# EasyEDA Pro project AG6NS_PicoBalloon_RP2040_v0.4.eprj, board PCB1
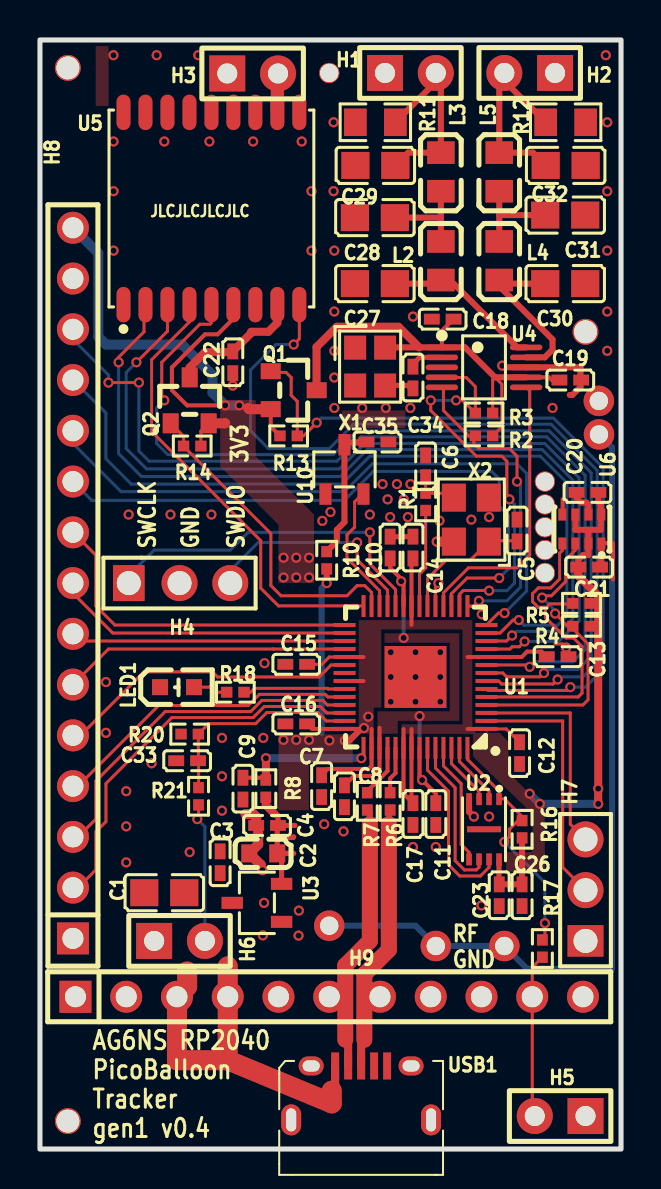
[diagram p1: board, top side]
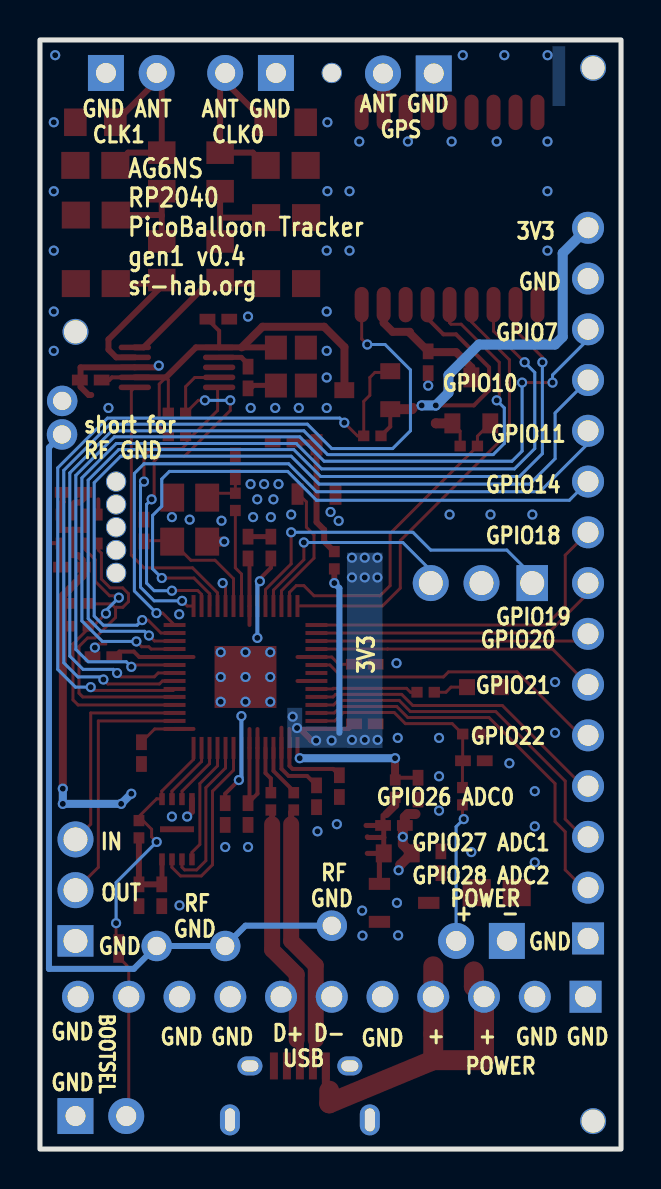
[diagram p2: board, bottom side, seen from below]

Outline 29.08 x 55.5 mm; copper layers: Top Layer, Bottom Layer. Coordinates in mm from the lower left corner of the outline.
Outline path: rectangle 0,55.5 29.08,0
Stack: Top Layer 0.035mm / Dielectric1 1.51mm FR4 er 4.5 / Bottom Layer 0.035mm

## Design rules (mm)
spacing safeClearance (default): track to track 0.152, other pairs 0.152 to 0.3
track width trackWidth (default): min 0.127, default 0.254, max 2.54
differential pair differentialPair (default): width min 0.127, default 0.254, max 2.54; gap min 0.152, default 0.152
via viaSize (default): diameter min 0.5, default 0.61, max 10; hole min 0.3, default 0.305, max 6

## Placement (name value [footprint] x y rotation side)
C1  22uF  [C0805]  6.22 12.83 0 top
C2  22uF  [C0603]  11.18 14.8 0 top
C3  100nF  [C0402_NEW]  9.02 14.35 270 top
C4  100nF  [C0402_NEW]  11.37 16.19 0 top
C5  33pF  [C0402]  23.88 30.95 270 top
C6  33pF  [C0402]  19.3 34.16 270 top
C7  2.2uF  [C0402]  14.1 18.16 90 top
C8  2.2uF  [C0402]  15.24 17.65 90 top
C9  2.2uF  [C0402]  10.16 18.03 90 top
C10  100nF  [C0402_NEW]  17.53 30.1 270 top
C11  100nF  [C0402_NEW]  19.81 16.76 90 top
C12  100nF  [C0402_NEW]  24 19.81 90 top
C13  100nF  [C0402_NEW]  25.91 24.64 180 top
C14  100nF  [C0402_NEW]  18.67 30.1 270 top
C15  100nF  [C0402_NEW]  12.83 24.26 0 top
C16  100nF  [C0402_NEW]  12.83 21.27 0 top
C17  100nF  [C0402_NEW]  18.67 16.76 90 top
C18  100nF  [C0402_NEW]  20.16 41.53 0 top
C19  100nF  [C0402_NEW]  26.54 38.48 180 top
C20  100nF  [C0402_NEW]  27.4 32.86 0 top
C21  100nF  [C0402_NEW]  27.49 29.12 180 top
C22  100nF  [C0402_NEW]  9.65 39.37 90 top
C23  100nF  [C0402_NEW]  22.99 12.7 90 top
C26  2.2uF  [C0402]  24.13 12.7 90 top
C27  330pF  [C0805]  16.76 43.31 0 top
C28  330pF  [C0805]  16.76 46.61 0 top
C29  330pF  [C0805]  16.79 49.22 0 top
C30  330pF  [C0805]  26.29 43.31 180 top
C31  330pF  [C0805]  26.29 46.74 180 top
C32  330pF  [C0805]  26.31 49.22 180 top
C33  1nF  [C0402]  7.37 19.43 0 top
C34  100nF  [C0402_NEW]  18.67 38.61 270 top
C35  100nF  [C0402_NEW]  16.89 35.38 180 top
H1  210-91-02GB01  [HDR-TH_2P-P2.54-V-M-1]  18.54 53.85 0 top
H2  210-91-02GB01  [HDR-TH_2P-P2.54-V-M-1]  24.51 53.85 180 top
H3  210-91-02GB01  [HDR-TH_2P-P2.54-V-M-1]  10.64 53.82 0 top
H4  B-2100S03P-A110  [HDR-TH_3P-P2.54-V-M-1]  6.99 28.32 0 top
H5  210-91-02GB01  [HDR-TH_2P-P2.54-V-M-1]  26.03 1.65 180 top
H6  210-91-02GB01  [HDR-TH_2P-P2.54-V-M-1]  6.99 10.41 0 top
H7  B-2100S03P-A110  [HDR-TH_3P-P2.54-V-M-1]  27.31 12.95 90 top
H8  B-2100S15P-A110  [HDR-TH_15P-P2.54-V-M]  1.65 28.32 90 top
H9  A2541WV-11P  [HDR-TH_11P-P2.54-V-M]  14.48 7.62 0 top
L2  820nH  [L0805]  20.07 44.45 90 top
L3  820nH  [L0805]  20.07 48.9 90 top
L4  820nH  [L0805]  22.99 44.45 90 top
L5  820nH  [L0805]  22.99 48.9 90 top
LED1  GREEN  [LED0603-R-RD]  6.86 23.11 0 top
NOREF  -  [Pad_e5590]  1.4 1.4 0 top
NOREF#2  -  [Pad_e19824]  27.97 37.44 0 top
NOREF#3  -  [Pad_e4428]  23.24 10.16 0 top
NOREF#4  -  [Pad_e5896]  1.4 54.1 0 top
NOREF#5  -  [Pad_e19751]  27.98 35.76 0 top
NOREF#6  -  [Pad_e13409]  25.27 29.97 0 top
NOREF#7  -  [Pad_e5895]  27.31 40.89 0 top
NOREF#8  -  [Pad_e13209]  25.27 32.26 0 top
NOREF#9  -  [Pad_e12433]  25.27 33.4 0 top
NOREF#10  -  [Pad_e28937]  14.48 53.85 0 top
NOREF#11  -  [Pad_e13408]  25.27 31.12 0 top
NOREF#12  -  [Pad_e9054]  19.81 10.16 0 top
NOREF#13  -  [Pad_e6]  14.48 11.18 0 top
NOREF#14  -  [Pad_e18196]  25.27 28.83 0 top
Q1  AO3401A  [SOT-23_L2.9-W1.3-P1.90-LS2.4-BR]  12.7 37.97 180 top
Q2  AO3401A  [SOT-23_L2.9-W1.3-P1.90-LS2.4-BR]  7.49 37.47 270 top
R1  1kΩ  [R0402]  19.3 32.39 270 top
R2  3.3kΩ  [R0402]  22.22 35.69 0 top
R3  3.3kΩ  [R0402]  22.22 36.83 0 top
R4  10kΩ  [R0402]  27.1 26.16 0 top
R5  10kΩ  [R0402]  27.1 27.31 0 top
R6  22  [R0402]  17.53 17.4 270 top
R7  22  [R0402]  16.38 17.4 270 top
R8  200Ω  [R0402]  11.3 18.03 270 top
R10  10kΩ  [R0402]  14.35 29.46 270 top
R11  2kΩ  [R0805]  16.79 51.38 0 top
R12  2kΩ  [R0805]  26.31 51.38 180 top
R13  10kΩ  [R0402]  12.45 35.69 180 top
R14  10kΩ  [R0402]  7.62 35.18 0 top
R16  10kΩ  [R0402]  24.13 16 270 top
R17  1kΩ  [R0402]  25.15 10.03 270 top
R18  6.8kΩ  [R0402]  9.78 22.86 0 top
R20  100kΩ  [R0402]  7.49 20.76 180 top
R21  200kΩ  [R0402]  7.94 17.65 270 top
U1  RP2040  [LQFN-56_L7.0-W7.0-P0.4-EP]  18.8 23.62 180 top
U2  W25Q16JVUXIQ  [USON-8_L3.0-W2.0-P0.50-BL-EP]  22.22 16 180 top
U3  3.3V LDO  [SOT-23-3_L2.9-W1.6-P1.90-LS2.8-BR]  10.86 12.32 0 top
U4  MS5351M  [MSOP-10_L3.0-W3.0-P0.50-LS5.0-BL]  22.22 39.12 270 top
U5  ATGM336H-5N31  [GPSM-SMD_ATGM336H-TR]  8.58 47.07 180 top
U6  BMP280  [WLGA-8_L2.5-W2.0-P0.65-TR_DPS422]  27.12 31.03 270 top
U10  MAX809STRG  [SOT-23-3_L2.9-W1.6-P1.90-LS2.8-BR]  15.24 34.01 270 top
USB1  Micro-USB Connector  [MICRO-USB-SMD_10118194-0001LF]  16.07 2.81 0 top
X1  26MHz  [OSC-SMD_4P-L2.5-W2.0-BL]  16.52 39.15 270 top
X2  12MHz  [OSC-SMD_4P-L3.2-W2.5-BL]  21.59 31.5 90 top

## Footprints (pads in the part's own frame, mm; a bottom-side part is the same pattern mirrored in y, then rotated)
C0402
  rect 0.79x0.54 smd: 1(-0.545,0) 2(0.545,0)
C0402_NEW
  rect 0.79x0.54 smd: 1(-0.545,0) 2(0.545,0)
C0603
  rect 0.8x0.9 smd: 1(-0.7,0) 2(0.7,0)
C0805
  rect 1.41x1.35 smd: 1(-1,0) 2(1,0)
GPSM-SMD_ATGM336H-TR
  oval 0.7x1.773 smd: 1(4.4,4.811) 2(3.3,4.811) 3(2.2,4.811) 4(1.1,4.811) 5(0,4.811) 6(-1.1,4.811) 7(-2.2,4.811) 8(-3.3,4.811) 9(-4.4,4.811) 10(-4.4,-4.811) 11(-3.3,-4.811) 12(-2.2,-4.811) 13(-1.1,-4.811) 14(0,-4.811) 15(1.1,-4.811) 16(2.2,-4.811) 17(3.3,-4.811) 18(4.4,-4.811)
HDR-TH_2P-P2.54-V-M-1
  rect 1.8x1.8 hole 1: 1(-1.27,0)
  round 1.8 hole 1: 2(1.27,0)
HDR-TH_3P-P2.54-V-M-1
  rect 1.575x1.8 hole 1.2: 1(-2.54,0)
  round 1.8 hole 1.2: 2(0,0) 3(2.54,0)
HDR-TH_11P-P2.54-V-M
  rect 1.6x1.6 hole 1.05: 1(-12.7,0)
  round 1.6 hole 1.05: 2(-10.16,0) 3(-7.62,0) 4(-5.08,0) 5(-2.54,0) 6(0,0) 7(2.54,0) 8(5.08,0) 9(7.62,0) 10(10.16,0) 11(12.7,0)
HDR-TH_15P-P2.54-V-M
  rect 1.6x1.6 hole 1.05: 1(-17.78,0)
  round 1.6 hole 1.05: 2(-15.24,0) 3(-12.7,0) 4(-10.16,0) 5(-7.62,0) 6(-5.08,0) 7(-2.54,0) 8(0,0) 9(2.54,0) 10(5.08,0) 11(7.62,0) 12(10.16,0) 13(12.7,0) 14(15.24,0) 15(17.78,0)
L0805
  rect 1.133x1.377 smd: 1(-0.966,0) 2(0.966,0)
LED0603-R-RD
  rect 0.8x0.8 smd: 1(0.851,0) 2(-0.851,0)
LQFN-56_L7.0-W7.0-P0.4-EP
  rect 1.1x0.2 smd: 1(-3.55,2.6) 2(-3.55,2.2) 3(-3.55,1.8) 4(-3.55,1.4) 5(-3.55,1) 6(-3.55,0.6) 7(-3.55,0.2) 8(-3.55,-0.2) 9(-3.55,-0.6) 10(-3.55,-1) 11(-3.55,-1.4) 12(-3.55,-1.8) 13(-3.55,-2.2) 14(-3.55,-2.6) 29(3.55,-2.6) 30(3.55,-2.2) 31(3.55,-1.8) 32(3.55,-1.4) 33(3.55,-1) 34(3.55,-0.6) 35(3.55,-0.2) 36(3.55,0.2) 37(3.55,0.6) 38(3.55,1) 39(3.55,1.4) 40(3.55,1.8) 41(3.55,2.2) 42(3.55,2.6)
  rect 0.2x1.1 smd: 15(-2.6,-3.55) 16(-2.2,-3.55) 17(-1.8,-3.55) 18(-1.4,-3.55) 19(-1,-3.55) 20(-0.6,-3.55) 21(-0.2,-3.55) 22(0.2,-3.55) 23(0.6,-3.55) 24(1,-3.55) 25(1.4,-3.55) 26(1.8,-3.55) 27(2.2,-3.55) 28(2.6,-3.55) 43(2.6,3.55) 44(2.2,3.55) 45(1.8,3.55) 46(1.4,3.55) 47(1,3.55) 48(0.6,3.55) 49(0.2,3.55) 50(-0.2,3.55) 51(-0.6,3.55) 52(-1,3.55) 53(-1.4,3.55) 54(-1.8,3.55) 55(-2.2,3.55) 56(-2.6,3.55)
  rect 3.1x3.1 smd: 57(0,0)
MICRO-USB-SMD_10118194-0001LF
  rect 0.4x1.35 smd: 1(-1.3,1.35) 2(-0.65,1.35) 3(0,1.35) 4(0.65,1.35) 5(1.3,1.35)
  oval 1x1.55 hole 0.5x1.15: 6(-3.5,-1.35) 6(3.5,-1.35)
  oval 1.25x0.95 hole 0.85x0.55: 6(-2.5,1.35) 6(2.5,1.35)
MSOP-10_L3.0-W3.0-P0.50-LS5.0-BL
  oval 0.28x1.62 smd: 1(-1,-2.11) 2(-0.5,-2.11) 3(0,-2.11) 4(0.5,-2.11) 5(1,-2.11) 6(1,2.11) 7(0.5,2.11) 8(0,2.11) 9(-0.5,2.11) 10(-1,2.11)
OSC-SMD_4P-L2.5-W2.0-BL
  rect 1.2x1.1 smd: 1(-0.95,-0.75) 2(0.95,-0.75) 3(0.95,0.75) 4(-0.95,0.75)
OSC-SMD_4P-L3.2-W2.5-BL
  rect 1.4x1.2 smd: 1(-1.1,-0.875) 2(1.1,-0.875) 3(1.1,0.875) 4(-1.1,0.875)
Pad_e6
  round 1.524 hole 0.914: 6(0,0)
Pad_e4428
  round 1.524 hole 0.914: 1(0,0)
Pad_e5590
  round 1.3 hole 1.152: 3(0,0)
Pad_e5895
  round 1.3 hole 1.152: 2(0,0)
Pad_e5896
  round 1.3 hole 1.152: 1(0,0)
Pad_e9054
  round 1.524 hole 0.914: 5(0,0)
Pad_e12433
  round 1.016 hole 0.914: 0(0,0)
Pad_e13209
  round 1.016 hole 0.914: 0(0,0)
Pad_e13408
  round 1.016 hole 0.914: 0(0,0)
Pad_e13409
  round 1.016 hole 0.914: 0(0,0)
Pad_e18196
  round 1.016 hole 0.914: 0(0,0)
Pad_e19751
  round 1.524 hole 0.914: 2(0,0)
Pad_e19824
  round 1.524 hole 0.914: 3(0,0)
Pad_e28937
  round 1.016 hole 0.914: 0(0,0)
R0402
  rect 0.566x0.54 smd: 1(-0.433,0) 2(0.433,0)
R0805
  rect 1.133x1.377 smd: 1(-1,0) 2(1,0)
SOT-23-3_L2.9-W1.6-P1.90-LS2.8-BR
  rect 1.07x0.6 smd: 1(1.235,-0.95) 2(1.235,0.95) 3(-1.235,0)
SOT-23_L2.9-W1.3-P1.90-LS2.4-BR
  rect 1x0.8 smd: 1(1.15,-0.95) 2(1.15,0.95) 3(-1.15,0)
USON-8_L3.0-W2.0-P0.50-BL-EP
  rect 0.28x0.6 smd: 1(-0.75,-1.508) 2(-0.25,-1.508) 3(0.25,-1.508) 4(0.75,-1.508) 5(0.75,1.508) 6(0.25,1.508) 7(-0.25,1.508) 8(-0.75,1.508)
  rect 1.7x0.3 smd: 9(0,0)
WLGA-8_L2.5-W2.0-P0.65-TR_DPS422
  rect 0.6x0.4 smd: 1(0.725,0.975) 2(0.725,0.325) 3(0.725,-0.325) 4(0.725,-0.975) 5(-0.725,-0.975) 6(-0.725,-0.325) 7(-0.725,0.325) 8(-0.725,0.975)

## Nets
As in the schematic, except:
GND: C1.1 C2.1 C3.1 C4.1 C5.1 C6.1 C7.1 C8.1 C9.1 C10.1 C11.1 C12.1 C13.1 C14.1 C15.1 C16.1 C17.1 C18.1 C19.1 C20.1 C21.1 C22.1 C23.1 C26.1 C27.1 C28.1 C29.1 C30.1 C31.1 C32.1 C33.1 C35.1 H1.1 H2.1 H3.1 H4.2 H5.1 H6.1 H7.1 H8.1 H8.14 H9.1 H9.2 H9.5 H9.8 H9.9 H9.11 LED1.2 NOREF#2.3 R11.1 R12.1 R20.2 U1.19 U1.57 U2.4 U3.1 U4.8 U5.1 U5.10 U5.12 U6.1 U6.5 U6.7 U10.1 USB1.5 USB1.6 X1.1 X1.2 X2.2 X2.4
RFGND: NOREF#3.1 NOREF#5.2 NOREF#12.5 NOREF#13.6

Pads without a net: NOREF 3; NOREF#4 1; NOREF#6 0; NOREF#7 2; NOREF#8 0; NOREF#9 0; NOREF#10 0; NOREF#11 0; NOREF#14 0; U2 9; U4 3; U5 7 13 14 15 16 17 18; USB1 4

## Via types
v1: diameter 0.508, hole 0.3, Top Layer to Bottom Layer, 141 vias

## Routing (per net, layer and track width the routed paths; a pad name or vN(x,y) marks a point on that pad's centre or on a via; arc(x,y) is an arc through that point)
1V1: length 16
  Top Layer w0.2: 17.53,29.54 17.53,29.08 18.2,28.41 U1.23 ; 17,21.08 U1.45 17,19.03 16.64,18.67 15.71,18.67 C8.2 ; C11.2 19.81,17.78 19,18.6 U1.50
  Bottom Layer w0.2: v1(18.08,28.41) 18.2,28.29 v1(18.2,25.58) ; v1(19,21.67) 19,18.59 v1(19.13,18.46)
3V3: length 102.3
  Top Layer w0.15: U1.33 14.48,24.62 14.11,24.26 C15.2 ; 22.35,21.02 23.34,21.02 C12.2 ; R14.2 8.05,35.93 8.44,36.32
  Top Layer w0.2: C13.2 25.11,24.89 24.38,24.89 24.11,24.62 U1.10 21.4,24.62 ; 22.35,21.02 21.4,21.02 ; U5.6 9.68,41.56 8.89,40.77 8.25,40.77 6.6,39.12 6.6,37.97 7.37,37.21 v1(9.27,37.21) ; 28.07,31.72 U6.8 ; 16.22,21.02 16.17,21.02 ; 16.17,21.02 13.62,21.02 C16.2 ; 16.17,21.02 v1(16.22,21.07) ; Q1.2 11.55,36.15 R13.2 ; 18.6,21.02 U1.49 18.6,17.38 ; 18.6,17.38 18.2,17.78 U1.48 18.2,21.02 ; 18.6,17.38 C17.2 ; C7.2 14.41,19.02 16.45,19.02 16.6,19.17 U1.44 16.6,21.02 ; U1.36 16.19,23.42 ; 18.6,26.23 U1.22 18.6,29.48 C14.2 18.67,29.68 ; U1.33 16.19,24.62
  Top Layer w0.25: U2.8 22.97,13.26 C23.2
  Top Layer w0.254: 12.7,15.62 12.67,15.59 11.88,15.59 ; C4.2 11.91,16.7 ; C4.2 12.76,16.19 ; C4.2 11.88,16.16 11.88,15.59 ; C2.2 12.09,14.58 U3.2 ; C2.2 11.88,15.59 ; C2.2 12.7,14.8
  Top Layer w0.3: 27.43,30.99 26.8,30.99 26.8,31.75 ; 27.43,30.99 28.07,30.99 28.07,31.72 ; 27.43,30.99 27.45,30.97 27.45,29.73 27.43,29.72 27.18,29.72 26.94,29.48 C21.2 ; 16.07,21.02 15.49,20.44 v1(15.26,20.44) ; C23.2 C26.2 R16.2 ; C20.2 27.95,32.38 28.07,32.26 28.07,31.78 U6.8 ; v1(14.35,28.32) R10.2
  Top Layer w0.4: 11.75,16.76 11.3,17.21 R8.2 ; v1(27.94,17.27) v1(27.94,18.03) 27.94,27.69 26.94,28.69 C21.2
  Top Layer w0.5: Q1.2 10.47,37.02 10.41,37.08 ; 8.44,36.32 9.26,36.32 9.27,36.32
  Bottom Layer w0.3: 14.1,20.83 14.1,28.07 v1(14.35,28.32)
  Bottom Layer w0.4: v1(27.94,18.03) v1(27.94,17.27) v1(25.02,17.27) v1(24.51,17.78)
  Bottom Layer w0.5: v1(9.98,37.21) v1(9.27,37.21) 8.64,37.85 8.64,38.74 7.11,40.26 3.3,40.26 2.92,40.64 2.92,44.83 H8.15
  vias: v1(12.19,29.59) v1(12.19,28.6) v1(12.19,20.47) v1(12.83,29.59) v1(12.83,28.6) v1(12.83,20.47) v1(13.47,29.59) v1(13.47,28.6) v1(13.47,20.47) v1(14.49,20.44) v1(16.43,21.64)
GND: length 20.9
  Top Layer w0.15: 25.78,25.27 26.16,25.27 v1(26.33,25.09) 26.45,24.98 C13.1 ; U1.19 19.8,28.18 v1(19.94,28.32)
  Top Layer w0.2: 28.09,30.32 28.66,30.32 28.68,30.29 28.68,28.51 ; 26.16,32.51 26.16,31.77 U6.5 ; v1(9.65,38.2) C22.1
  Top Layer w0.254: C10.1 C14.1
  Top Layer w0.3: 27.45,31.75 27.45,32.24 27.34,32.35 27.08,32.35 26.86,32.58 C20.1 ; C21.1 28.07,29.16 28.07,29.72 28.1,29.75 U6.1 ; v1(23.14,39.2) 23.22,39.12 U4.8 27.05,39.12 27.05,38.14 26.65,37.73 26.52,37.73 ; v1(21.72,16.64) 21.47,16.88 U2.4
  Top Layer w0.5: 11.05,14.22 11.05,14.22 C2.1 10.92,15.24 v1(10.92,15.62) 10.92,16.09 C4.1 10.82,16.61 10.67,16.76 10.29,16.76 ; v1(19.86,30.4) X2.4
  vias: v1(3.3,23.37) v1(3.3,20.83) v1(3.68,54.74) v1(3.68,50.42) v1(3.68,47.93) v1(3.68,44.96) v1(4.32,17.91) v1(4.32,16.15) v1(4.32,14.34) v1(4.44,31.75) v1(5.59,19.3) v1(5.84,54.74) v1(6.22,50.42) v1(6.53,31.75) v1(7.49,14.86) v1(7.92,54.74) v1(8.48,50.42) v1(8.58,31.75) v1(9.11,20.57) v1(9.11,18.65) v1(9.11,16.93) v1(10.67,50.42) v1(11.13,13.95) v1(11.24,24.31) v1(11.18,20.57) v1(11.22,12.32) v1(11.16,10.69) v1(12.94,10.68) v1(12.96,11.93) v1(13.1,50.42) v1(13.59,47.93) v1(13.59,44.96) v1(14.13,31.43) v1(14.22,16.26) v1(14.54,31.88) v1(14.7,51.38) v1(14.7,47.93) v1(14.73,44.96) v1(14.73,41.91) v1(14.73,39.94) v1(14.73,38.61) v1(14.73,37.08) v1(15.19,15.9) v1(16.13,37.08) v1(16.51,31.75) v1(17.15,33.27) v1(17.31,37.08) v1(17.4,32.51) v1(17.53,31.62) v1(17.56,24.86) v1(17.56,23.62) v1(17.56,22.38) v1(17.87,33.27) v1(18.21,32.51) v1(18.41,31.62) v1(18.54,37.08) v1(18.54,33.27) v1(18.67,41.66) v1(18.67,15.11) v1(18.8,24.86) v1(18.8,23.62) v1(18.8,22.38) v1(19.81,15.11) v1(20,31.44) v1(20.04,24.86) v1(20.04,23.62) v1(20.04,22.38) v1(21.59,31.5) v1(22.11,26.76) v1(22.1,12.19) v1(22.48,31.62) v1(22.48,16.64) v1(25.65,37.08) v1(28.32,54.74) v1(28.39,51.38) v1(28.39,47.93) v1(28.39,44.96) v1(28.39,41.91) v1(28.39,39.94)
VBUS: length 26.5
  Top Layer w0.15: 7.94,17.22 7.94,16.57 v1(7.87,16.51)
  Top Layer w0.4: 14.6,2.92 14.77,3.09 USB1.1
  Top Layer w1: 9.4,4.45 14.6,2.29 14.6,2.92 ; 9.4,4.45 6.86,4.45 H9.3 7.37,8.13 7.37,8.89 ; 9.4,4.45 H9.4 9.4,9.14
  Bottom Layer w0.15: v1(7.87,16.51) 8.25,16.13 H6.2
ADC0: length 15.7
  Top Layer w0.15: 1.65,17.91 5.94,22.2 10.42,22.2 10.98,22.75 14.28,22.75 14.41,22.62 U1.38
ADC1: length 17.7
  Top Layer w0.15: 1.65,15.37 2.79,16.51 2.79,18.42 6.27,21.89 10.55,21.89 11.1,22.45 14.16,22.45 14.38,22.22 U1.39
ADC2: length 19.8
  Top Layer w0.15: 1.65,12.83 2.79,13.97 2.79,15.88 3.3,16.38 3.3,18.29 6.6,21.59 10.67,21.59 11.23,22.15 14.03,22.15 14.36,21.82 U1.40
ADC_AVDD: length 7.1
  Top Layer w0.2: C9.2 11.19,18.58 R8.1
  Top Layer w0.4: R8.1 11.31,18.47 v1(11.31,19.56)
  Bottom Layer w0.4: v1(16.08,19.56) v1(11.31,19.56)
BATT_V: length 10.6
  Top Layer w0.15: R21.1 7.94,19.4 C33.2 7.93,19.45 R20.1 8.45,21.29 10.8,21.29 11.35,21.84 13.91,21.84 14.33,21.42 U1.41
BOOTSEL: length 8.2
  Top Layer w0.15: H5.2 24.64,1.78 H9.10 24.64,9.09 R17.2
GPIO7: length 46.3
  Top Layer w0.15: U1.9 24.42,24.22 v1(24.51,24.13) ; v1(3.43,38.35) v1(4.95,38.35)
  Bottom Layer w0.15: v1(3.43,38.35) 3.43,38.74 1.91,40.26 1.91,40.77 H8.13 ; v1(4.95,38.35) 4.95,34.93 5.46,34.42 14.86,34.42 16.08,35.64 25.36,35.64 27.29,33.71 27.29,25 26.67,24.38 24.76,24.38 v1(24.51,24.13)
GPIO10: length 40.6
  Top Layer w0.15: v1(23.97,26.47) 23.68,26.47 23.03,25.82 U1.13
  Bottom Layer w0.15: H8.12 3.3,36.83 3.3,34.54 4.57,33.27 15.11,33.27 16.51,34.67 25.04,34.67 26.37,33.35 26.37,26.67 25.91,26.21 24.22,26.21 v1(23.97,26.47)
GPIO11: length 33.7
  Top Layer w0.15: v1(23.25,26.82) 22.94,26.82 U1.14
  Bottom Layer w0.15: v1(23.25,26.82) 24.36,27.92 24.36,33.81 23.88,34.29 16.64,34.29 15.24,32.89 4.06,32.89 1.65,35.31 H8.11
GPIO14: length 31.1
  Top Layer w0.15: v1(22.99,28.58) 21.38,28.58 20.59,27.78 20.59,27.19
  Bottom Layer w0.15: H8.10 2.59,32.46 15.24,32.46 16.68,33.91 22.61,33.91 22.99,33.53 22.99,32.16 23.45,31.7 23.45,29.03 v1(22.99,28.58)
GPIO18: length 17
  Top Layer w0.15: H8.9 2.79,29.72 2.79,27.18 3.75,26.22 U1.29
GPIO19: length 14.9
  Top Layer w0.15: H8.8 1.65,27.81 3.64,25.82 U1.30
GPIO20: length 13.7
  Top Layer w0.15: H8.7 2.01,25.42 U1.31
GPIO21: length 14.3
  Top Layer w0.15: H8.6 3.43,25.02 11.68,25.02 11.69,25.02 15.25,25.02
GPIO22: length 15.3
  Top Layer w0.15: H8.5 2.03,20.7 5.21,23.88 8.64,23.88 8.89,23.62 13.97,23.62 14.57,24.22 U1.34
GPS_1PPS: length 22.8
  Top Layer w0.15: U1.28 16.19,27.18 11.94,27.18 11.05,28.07 11.05,30.44 5.59,35.9 5.59,39.5 7.48,41.39 U5.4
GPS_3V3: length 6.7
  Top Layer w0.4: C22.2 10.57,40.84 10.57,40.89 11.43,40.89 11.88,41.35 U5.8 ; Q2.3 7.49,39.12 8.25,39.88 9.62,39.88
GPS_NRESET: length 42.7
  Top Layer w0.15: v1(25.91,23.5) 25.69,23.27 23.1,23.27 22.95,23.42 U1.7 ; U5.9 12.98,40.54 v1(12.7,40.26)
  Bottom Layer w0.15: v1(25.91,23.5) 26.03,23.62 27.18,23.62 27.89,24.34 27.89,33.96 25.58,36.27 15.7,36.27 14.48,35.05 11.43,35.05 10.54,35.94 10.54,38.99 11.81,40.26 v1(12.7,40.26)
GPS_ON: length 46.7
  Top Layer w0.15: v1(25.22,23.82) 25.04,23.63 23.36,23.63 23.17,23.82 U1.8 ; U5.5 8.58,41.35 8.51,41.28 8,41.28 6.1,39.37 6.1,37.59 v1(6.22,37.47)
  Bottom Layer w0.15: v1(25.22,23.82) 25.41,24 26.92,24 27.59,24.67 27.59,33.84 25.48,35.94 15.88,35.94 14.68,34.75 6.4,34.75 5.84,35.31 5.84,37.08 v1(6.22,37.47)
GPS_VCC_ON_N: length 16.5
  Top Layer w0.15: Q2.1 7.19,35.67 R14.1 7.19,35.17 11.56,30.8 11.56,28.19 12.06,27.69 15.37,27.69 15.88,28.19 16.26,28.19 16.6,27.85 U1.27
I2C0_SCL: length 20.9
  Top Layer w0.15: v1(19.56,37.47) 19.56,36.96 21.84,34.67 23.11,34.67 23.37,34.42 23.37,32.64 v1(23.5,32.51) ; v1(20.83,37.47) 21.16,37.47 R3.1 21.79,38.15 21.34,38.61 20.12,38.61 20.12,38.62 ; v1(22.48,27.94) 22.47,27.95 21.19,27.95 21,27.76 U1.16
  Bottom Layer w0.15: v1(23.5,32.51) 23.75,32.26 23.75,28.32 23.37,27.94 v1(22.48,27.94) ; v1(20.83,37.47) v1(19.56,37.47)
I2C0_SDA: length 15.8
  Top Layer w0.15: U1.15 21.71,27.17 v1(21.97,27.43) ; v1(23.88,33.4) 23.88,34.67 23.5,35.05 21.97,35.05 21.72,35.31 21.72,35.61 R2.1 21.46,35.69 20.19,36.96 20.19,38.04 20.12,38.12
  Bottom Layer w0.15: v1(21.97,27.43) 23.37,27.43 24.05,28.12 24.05,33.23 v1(23.88,33.4)
I2C1_SCL: length 16.2
  Top Layer w0.15: 25.3,27.07 25.3,26.6 26.32,25.58 26.7,25.58 27.13,25.15 27.13,22.81 26.94,22.62 U1.5 ; 25.3,27.07 25.51,27.28 26.64,27.28 R5.1 ; 25.3,27.07 25.26,27.11 24.94,27.11 24.65,27.39 24.65,27.79 24.94,28.08 25.57,28.08 26.01,28.52 26.01,29.82 26.15,29.96 U6.4
I2C1_SDA: length 15
  Top Layer w0.15: 26.8,30.3 26.8,29.97 26.31,29.49 26.31,28.4 25.6,27.69 25.23,27.69 v1(25.14,27.59) ; v1(25.78,26.8) 26.42,26.16 R4.1 26.67,26.04 27.43,25.27 27.43,22.48 27.18,22.22 U1.4
  Bottom Layer w0.15: v1(25.14,27.59) 25.78,26.95 v1(25.78,26.8)
LED: length 5.1
  Top Layer w0.15: R18.2 10.54,22.86 10.73,23.05 14.41,23.05 14.42,23.02 15.25,23.02
NRESET: length 6.7
  Top Layer w0.15: 16.19,32.83 15.75,32.39 15.75,31.12 15.37,30.73 15.37,29.57 17,27.94 U1.26
QSPI_SCLK: length 7.9
  Top Layer w0.15: U1.52 19.8,19.07 20.78,18.08 20.78,14.43 21.24,13.97 21.84,13.97 21.97,14.1 U2.6
QSPI_SD0: length 6.1
  Top Layer w0.15: U2.5 21.47,14.85 21.08,15.24 21.08,18.29 20.2,19.17 U1.53
QSPI_SD1: length 3.2
  Top Layer w0.15: U1.55 21,19.39 22.48,17.91 22.48,17.51 U2.2
QSPI_SD2: length 3.1
  Top Layer w0.15: U1.54 20.6,19.28 21.97,17.91 21.97,17.51 U2.3
QSPI_SD3: length 9.1
  Top Layer w0.15: U2.7 22.48,14.49 22.48,14.1 22.05,13.66 21.01,13.66 20.45,14.22 20.45,17.91 19.4,18.96 U1.51
QSPI_SS: length 12.3
  Top Layer w0.15: U1.56 21.4,19.5 22.99,17.91 22.99,17.52 ; v1(25.27,11.3) 25.27,10.59 25.15,10.47 ; 22.99,17.52 22.99,17.53 23.24,17.53 24.13,16.64 R16.1 23.93,16.44 23.5,16 23.5,15.62 v1(23.24,15.37) ; 22.99,17.52 U2.1
  Bottom Layer w0.15: v1(23.24,15.37) 25.27,13.34 v1(25.27,11.3)
RFGND: length 42.1
  Bottom Layer w0.3: NOREF#5.2 28.63,35.1 28.63,9.02 24.38,9.02 NOREF#3.1 NOREF#12.5 18.8,11.18 NOREF#13.6
SWCLK: length 17.6
  Top Layer w0.15: U1.24 17.8,28 16.51,29.28 v1(16.51,30.86)
  Bottom Layer w0.15: 4.44,28.32 4.44,28.7 5.72,29.97 9.53,29.97 10.41,30.86 v1(16.51,30.86)
SWD: length 11.4
  Top Layer w0.15: U1.25 17.4,27.97 15.88,29.49 v1(15.88,30.35)
  Bottom Layer w0.15: H4.3 9.53,28.96 10.92,30.35 v1(15.88,30.35)
UART0_RX: length 10.8
  Top Layer w0.15: U1.3 26.54,21.82 26.54,16.26 H7.3
UART0_TX: length 12.8
  Top Layer w0.15: H7.2 26.16,14.1 26.16,21.42 U1.2
UART1_RX: length 44.1
  Top Layer w0.15: U5.2 5.21,42.18 5.21,40.89 3.94,39.62 v1(3.94,39.37) ; U1.12 23.35,25.42 v1(23.63,25.7)
  Bottom Layer w0.15: v1(23.63,25.7) 23.84,25.91 26.03,25.91 26.67,26.54 26.67,33.47 25.14,35 16.38,35 15.03,33.66 5.08,33.66 3.94,34.8 v1(3.94,39.37)
UART1_TX: length 44.8
  Top Layer w0.15: v1(4.83,39.37) 6.38,40.93 U5.3 ; v1(24.26,25.4) 23.99,25.14 23.64,25.14 23.52,25.02 22.35,25.02
  Bottom Layer w0.15: v1(24.26,25.4) 25.96,25.4 26.98,26.43 26.98,33.59 25.26,35.31 16.26,35.31 14.99,34.04 5.33,34.04 4.32,35.05 4.32,38.86 v1(4.83,39.37)
USB_DM: length 13.4
  Top Layer w0.3: 16.51,16.26 16.51,16.84 R7.2
  Top Layer w0.4: USB1.2 15.42,5.33 15.28,5.47
  Top Layer w0.8: 15.28,5.47 15.28,9.19 16.51,10.41 16.51,16.26
USB_DP: length 13.4
  Top Layer w0.3: 17.46,16.26 17.46,16.9 R6.2
  Top Layer w0.4: 16.23,5.47 16.07,5.3 USB1.3
  Top Layer w0.8: 17.46,16.26 17.46,9.97 16.23,8.74 16.23,5.47
VFO_3V3: length 24.4
  Top Layer w0.15: R2.2 23.11,36.14 23.11,38.28 22.78,38.62 22.66,38.5 R3.2
  Top Layer w0.2: 20.12,40.12 20.12,40.94 C18.2 ; U4.7 25.48,38.62 25.62,38.48 C19.2
  Top Layer w0.3: U4.7 22.78,38.62 21.28,40.12 17.19,40.12 17.15,40.08
  Top Layer w0.4: Q1.3 13.84,37.98 13.84,40.13 14.86,41.15 17.95,41.15 18.98,40.12
VFO_CLK0: length 8
  Top Layer w0.3: C27.2 19.89,43.31 L2.1 20.52,43.48 23.89,40.12 U4.10
VFO_CLK1: length 8.2
  Top Layer w0.2: 23.16,43.31 L4.1
  Top Layer w0.3: U4.9 25.26,39.62 25.65,40.01 25.65,40.51 23.16,43 23.16,43.31 C30.2
VFO_CLK2: length 14.2
  Top Layer w0.15: 20.2,27.18 20.2,27.84 21.45,29.08 23.88,29.08 24.51,29.72 24.51,37.94 U4.6
VFO_VDD_ON_N: length 37.3
  Top Layer w0.15: 22.35,23.02 22.42,22.95 26.38,22.95 v1(26.54,23.11) ; v1(13.85,36.35) 13.19,35.69 R13.1 12.88,37.41 12.57,37.72 12.57,38.61 12.32,38.86 11.61,38.86 Q1.1
  Bottom Layer w0.15: v1(26.54,23.11) 27.31,23.11 28.19,24 28.19,34.09 25.7,36.58 14.08,36.58 13.85,36.35
XIN: length 6.7
  Top Layer w0.15: C5.2 23.84,30.44 22.51,30.44 X2.1 21.53,29.46 20.32,29.46 19.4,28.54 U1.20
XOUT: length 5
  Top Layer w0.15: 19.3,32.08 19.3,29.08 19,28.78 U1.21
$1N4791: length 1.8
  Top Layer w0.25: 20.12,39.62 19,39.62 18.54,39.15
$1N22007: length 2.7
  Top Layer w0.2: R7.1 16.38,17.91 17.4,18.92 U1.46
$1N22362: length 2.4
  Top Layer w0.2: U1.47 17.8,18.81 17.53,18.54 R6.1
$1N30851: length 4.8
  Top Layer w0.3: L3.1 L2.2 ; C28.2 20.06,46.61
$1N31392: length 9.9
  Top Layer w0.3: C29.2 18.43,49.86 L3.2 20.07,53.59 H1.2 19.81,53.41 R11.2
$1N33309: length 4.8
  Top Layer w0.3: C31.2 23.01,46.74 22.99,46.71 ; 22.99,46.71 L5.1 ; 22.99,46.71 L4.2
$1N33311: length 10
  Top Layer w0.3: R12.2 23.24,53.45 H2.2 22.99,53.59 L5.2 24.67,49.86 C32.2
$1N60185: length 1.5
  Top Layer w0.25: X1.3 17.2,38.2 17.19,38.22 18.39,38.22 18.54,38.06
$1N70752: length 2.4
  Top Layer w0.15: 19.34,33.69 19.3,33.66 R1.1 20.49,32.82 20.72,32.6
$1N107124: length 1.7
  Top Layer w0.15: R18.1 8.76,22.86 8.51,23.11 LED1.1
$1N115739: length 6.9
  Top Layer w0.3: 16.34,35.31 16.29,35.36 15.34,35.36 15.24,35.26 15.24,31.37 14.86,30.99 14.86,30.41 R10.1
GPS_ANT: length 2.1
  Top Layer w0.66: 11.91,53.95 11.88,53.92 U5.11

## Copper pours and planes (outline as drawn; the poured copper is in the pictures)
1V1 on Top Layer: 16.89,25.81 20.99,25.81 20.99,20.78 16.89,20.78
3V3 on Top Layer: 15.96,26.47 21.63,26.47 21.63,20.77 15.96,20.77
3V3 on Top Layer: 23.33,14.86 25.27,14.86 25.27,13.87 23.33,13.87
3V3 on Top Layer: 11.94,19.37 13.46,19.37 13.46,16.96 11.94,16.96
3V3 on Top Layer: 11.94,17.02 13.46,17.02 13.46,12.45 11.94,12.45
3V3 on Top Layer: 8.99,37.49 13.72,37.49 13.72,28.32 8.99,28.32
3V3 on Top Layer: 21.67,20.83 25.27,20.83 25.27,14.73 21.67,14.73
3V3 on Top Layer: 11.94,20.76 15.65,20.76 15.65,19.3 11.94,19.3
3V3 on Bottom Layer: 13.69,22.08 16.7,22.08 16.7,20.07 13.69,20.07
3V3 on Bottom Layer: 11.94,29.85 13.72,29.85 13.72,20.07 11.94,20.07
GND on Top Layer: 0,55.5 2.92,55.5 2.92,33.15 0,33.15
GND on Top Layer: 2.79,55.19 3.43,55.19 3.43,52.2 2.79,52.2
GND on Top Layer: 15.11,36.96 18.29,36.96 18.29,36.07 15.11,36.07
GND on Top Layer: 0,36.45 28.96,36.45 28.96,0 0,0
GND on Top Layer: 14.48,55.5 28.96,55.5 28.96,36.83 14.48,36.83
GND on Top Layer: 3.3,55.5 13.84,55.5 13.84,40.89 3.3,40.89
GND on Bottom Layer: 0,55.5 2.92,55.5 2.92,33.27 0,33.27
GND on Bottom Layer: 2.79,55.19 3.43,55.19 3.43,52.2 2.79,52.2
GND on Bottom Layer: 0,36.45 28.96,36.45 28.96,-0.13 0,-0.13
GND on Bottom Layer: 14.48,55.5 28.96,55.5 28.96,36.83 14.48,36.83
GND on Bottom Layer: 3.3,55.5 13.84,55.5 13.84,37.85 3.3,37.85
VBUS on Top Layer: 6.86,8.76 10.62,8.76 10.62,14.07 6.86,14.07

Small or netless copper shapes (teardrops, artwork), in the pictures only: 2 on Top Layer

## Text on the board
Bottom Silkscreen Layer: BOOTSEL | POWER | RF / GND | GND | 3V3 | - | GPIO7 | GPIO19 | GPIO11 | GPIO14 | GPIO18 | GPIO20 | + | GPIO21 | GPIO22 | GPIO10 | GPIO27 ADC1 | GPIO28 ADC2 | GPIO26 ADC0 | ANT GND / GPS | USB | D+ D- | ANT GND / CLK0 | OUT | IN | short for / RF GND | GND ANT / CLK1 | AG6NS / RP2040 / PicoBalloon Tracker / gen1 v0.4 / sf-hab.org
Top Silkscreen Layer: JLCJLCJLCJLC | RF / GND | SWCLK | GND | SWDIO | 3V3 | AG6NS RP2040 / PicoBalloon / Tracker / gen1 v0.4
